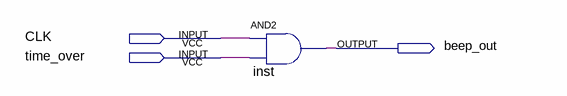
[diagram p0: schematic sheet]
// Quartus schematic Beep.bdf as structural Verilog: 1 symbols, 3 pins
module Beep (
  input  CLK,
  input  time_over,
  output beep_out
);

  and inst (beep_out, CLK, time_over);
endmodule
